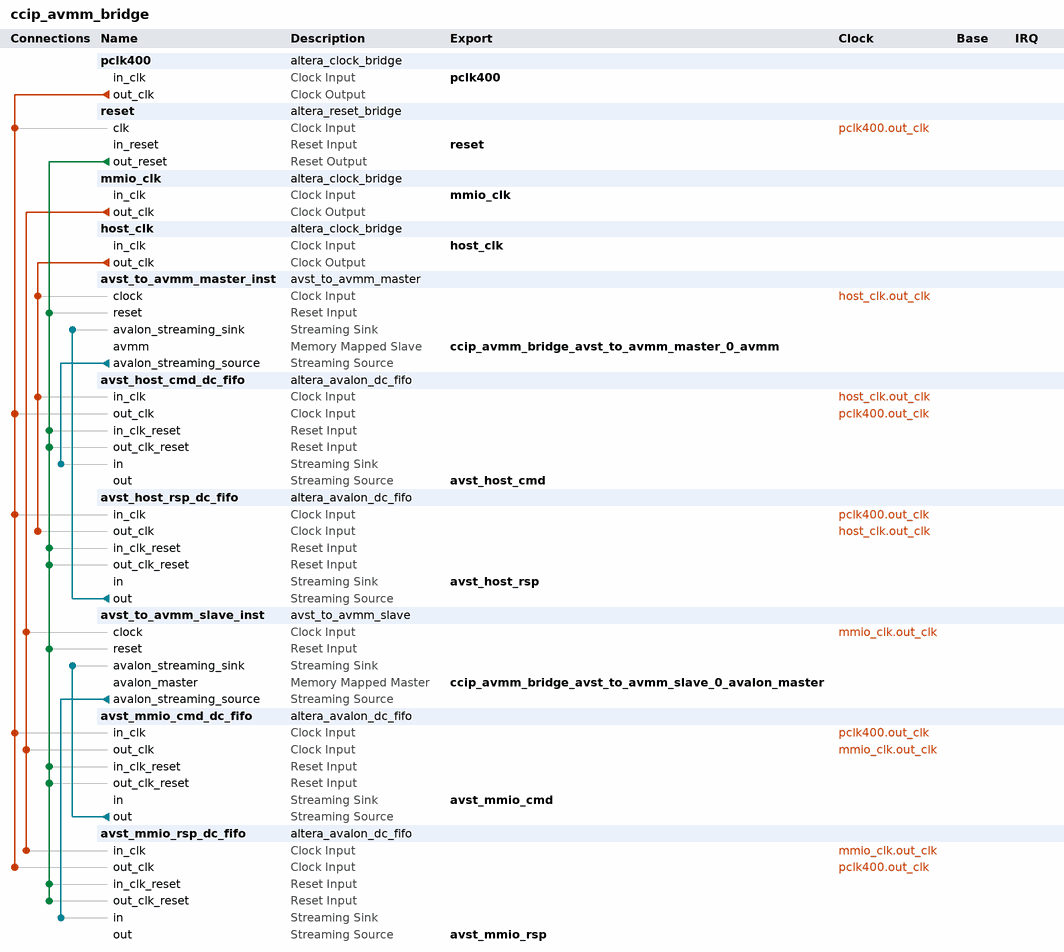
[diagram p0: system contents]
# Platform Designer (Qsys) system ccip_avmm_bridge, Arria 10 10AX115N3F40E2SG
# Parameters at their usual value, and those the tool derives, are not listed.
package require -exact qsys 1.0
create_system ccip_avmm_bridge
set_project_property DEVICE_FAMILY {Arria 10}
set_project_property DEVICE 10AX115N3F40E2SG

add_component pclk400 ip/ccip_avmm_bridge/ccip_avmm_bridge_clock_bridge_0.ip altera_clock_bridge pclk400 17.0
load_component pclk400
set_component_parameter_value DERIVED_CLOCK_RATE 400000000
set_component_parameter_value EXPLICIT_CLOCK_RATE 400
save_component

add_component reset ip/ccip_avmm_bridge/ccip_avmm_bridge_reset_bridge_0.ip altera_reset_bridge reset 17.0
load_component reset
set_component_parameter_value ACTIVE_LOW_RESET 0
set_component_parameter_value SYNCHRONOUS_EDGES both
save_component

add_component mmio_clk ip/ccip_avmm_bridge/ccip_avmm_bridge_clock_bridge_2.ip altera_clock_bridge mmio_clk 17.0
load_component mmio_clk
set_component_parameter_value DERIVED_CLOCK_RATE 0
set_component_parameter_value EXPLICIT_CLOCK_RATE 0
save_component

add_component host_clk ip/ccip_avmm_bridge/ccip_avmm_bridge_clock_bridge_3.ip altera_clock_bridge host_clk 17.0
load_component host_clk
set_component_parameter_value DERIVED_CLOCK_RATE 0
set_component_parameter_value EXPLICIT_CLOCK_RATE 0
save_component

add_component avst_to_avmm_master_inst ip/ccip_avmm_bridge/ccip_avmm_bridge_avst_to_avmm_master_0.ip avst_to_avmm_master avst_to_avmm_master_inst 1.0
load_component avst_to_avmm_master_inst
set_component_parameter_value AVMM_ADDR_WIDTH 48
set_component_parameter_value AVMM_DATA_WIDTH 512
set_component_parameter_value AVMM_BURST_WIDTH 3
set_component_parameter_value INGORE_BYTE_ENABLE 1
set_component_parameter_value INPUT_AVST_WIDTH 512
set_component_parameter_value AVST_BYTE_ENABLE_WIDTH 0
set_component_parameter_value AVST_OUTPUT_CONTROL_WIDTH 1
set_component_parameter_value OUTPUT_AVST_WIDTH 564
save_component

add_component avst_host_cmd_dc_fifo ip/ccip_avmm_bridge/ccip_avmm_bridge_dc_fifo_2.ip altera_avalon_dc_fifo avst_host_cmd_dc_fifo 17.0
load_component avst_host_cmd_dc_fifo
set_component_parameter_value BITS_PER_SYMBOL 564
set_component_parameter_value FIFO_DEPTH 16
set_component_parameter_value USE_PACKETS 0
save_component

add_component avst_host_rsp_dc_fifo ip/ccip_avmm_bridge/ccip_avmm_bridge_dc_fifo_3.ip altera_avalon_dc_fifo avst_host_rsp_dc_fifo 17.0
load_component avst_host_rsp_dc_fifo
set_component_parameter_value BITS_PER_SYMBOL 512
set_component_parameter_value FIFO_DEPTH 256
set_component_parameter_value USE_PACKETS 0
save_component

add_component avst_to_avmm_slave_inst ip/ccip_avmm_bridge/ccip_avmm_bridge_avst_to_avmm_slave_0.ip avst_to_avmm_slave avst_to_avmm_slave_inst 1.0
load_component avst_to_avmm_slave_inst
set_component_parameter_value AVMM_ADDR_WIDTH 18
set_component_parameter_value AVMM_DATA_WIDTH 64
save_component

add_component avst_mmio_cmd_dc_fifo ip/ccip_avmm_bridge/ccip_avmm_bridge_dc_fifo_0.ip altera_avalon_dc_fifo avst_mmio_cmd_dc_fifo 17.0
load_component avst_mmio_cmd_dc_fifo
set_component_parameter_value SYMBOLS_PER_BEAT 84
set_component_parameter_value BITS_PER_SYMBOL 1
set_component_parameter_value FIFO_DEPTH 64
set_component_parameter_value USE_PACKETS 0
save_component

add_component avst_mmio_rsp_dc_fifo ip/ccip_avmm_bridge/ccip_avmm_bridge_dc_fifo_1.ip altera_avalon_dc_fifo avst_mmio_rsp_dc_fifo 17.0
load_component avst_mmio_rsp_dc_fifo
set_component_parameter_value SYMBOLS_PER_BEAT 8
set_component_parameter_value BITS_PER_SYMBOL 8
set_component_parameter_value FIFO_DEPTH 64
set_component_parameter_value USE_PACKETS 0
save_component

# connections
add_connection host_clk.out_clk avst_host_cmd_dc_fifo.in_clk clock
add_connection host_clk.out_clk avst_host_rsp_dc_fifo.out_clk clock
add_connection host_clk.out_clk avst_to_avmm_master_inst.clock clock
add_connection mmio_clk.out_clk avst_mmio_cmd_dc_fifo.out_clk clock
add_connection mmio_clk.out_clk avst_mmio_rsp_dc_fifo.in_clk clock
add_connection mmio_clk.out_clk avst_to_avmm_slave_inst.clock clock
add_connection pclk400.out_clk avst_host_cmd_dc_fifo.out_clk clock
add_connection pclk400.out_clk avst_host_rsp_dc_fifo.in_clk clock
add_connection pclk400.out_clk avst_mmio_cmd_dc_fifo.in_clk clock
add_connection pclk400.out_clk avst_mmio_rsp_dc_fifo.out_clk clock
add_connection pclk400.out_clk reset.clk clock
add_connection reset.out_reset avst_host_cmd_dc_fifo.in_clk_reset reset
add_connection reset.out_reset avst_host_cmd_dc_fifo.out_clk_reset reset
add_connection reset.out_reset avst_host_rsp_dc_fifo.in_clk_reset reset
add_connection reset.out_reset avst_host_rsp_dc_fifo.out_clk_reset reset
add_connection reset.out_reset avst_mmio_cmd_dc_fifo.in_clk_reset reset
add_connection reset.out_reset avst_mmio_cmd_dc_fifo.out_clk_reset reset
add_connection reset.out_reset avst_mmio_rsp_dc_fifo.in_clk_reset reset
add_connection reset.out_reset avst_mmio_rsp_dc_fifo.out_clk_reset reset
add_connection reset.out_reset avst_to_avmm_master_inst.reset reset
add_connection reset.out_reset avst_to_avmm_slave_inst.reset reset
add_connection avst_host_rsp_dc_fifo.out avst_to_avmm_master_inst.avalon_streaming_sink avalon_streaming
add_connection avst_mmio_cmd_dc_fifo.out avst_to_avmm_slave_inst.avalon_streaming_sink avalon_streaming
add_connection avst_to_avmm_master_inst.avalon_streaming_source avst_host_cmd_dc_fifo.in avalon_streaming
add_connection avst_to_avmm_slave_inst.avalon_streaming_source avst_mmio_rsp_dc_fifo.in avalon_streaming

# exported interfaces
add_interface avst_host_cmd avalon_streaming source
set_interface_property avst_host_cmd EXPORT_OF avst_host_cmd_dc_fifo.out
add_interface avst_host_rsp avalon_streaming sink
set_interface_property avst_host_rsp EXPORT_OF avst_host_rsp_dc_fifo.in
add_interface avst_mmio_cmd avalon_streaming sink
set_interface_property avst_mmio_cmd EXPORT_OF avst_mmio_cmd_dc_fifo.in
add_interface avst_mmio_rsp avalon_streaming source
set_interface_property avst_mmio_rsp EXPORT_OF avst_mmio_rsp_dc_fifo.out
add_interface ccip_avmm_bridge_avst_to_avmm_master_0_avmm avalon slave
set_interface_property ccip_avmm_bridge_avst_to_avmm_master_0_avmm EXPORT_OF avst_to_avmm_master_inst.avmm
add_interface ccip_avmm_bridge_avst_to_avmm_slave_0_avalon_master avalon master
set_interface_property ccip_avmm_bridge_avst_to_avmm_slave_0_avalon_master EXPORT_OF avst_to_avmm_slave_inst.avalon_master
add_interface host_clk clock sink
set_interface_property host_clk EXPORT_OF host_clk.in_clk
add_interface mmio_clk clock sink
set_interface_property mmio_clk EXPORT_OF mmio_clk.in_clk
add_interface pclk400 clock sink
set_interface_property pclk400 EXPORT_OF pclk400.in_clk
add_interface reset reset sink
set_interface_property reset EXPORT_OF reset.in_reset

set_interconnect_requirement {$system} qsys_mm.clockCrossingAdapter HANDSHAKE
set_interconnect_requirement {$system} qsys_mm.enableEccProtection FALSE
set_interconnect_requirement {$system} qsys_mm.insertDefaultSlave FALSE
set_interconnect_requirement {$system} qsys_mm.maxAdditionalLatency 1

save_system ccip_avmm_bridge.qsys
